# Altium schematic sheet Block Diagram.SchDoc: Safety - Block Diagram
size Letter; DrawnBy: Qinyang Bao; Organization: UW Robotics; Address1: 200 University Avenue; Address2: Waterloo; Address3: Ontario; Address4: Canada N2L 3G6
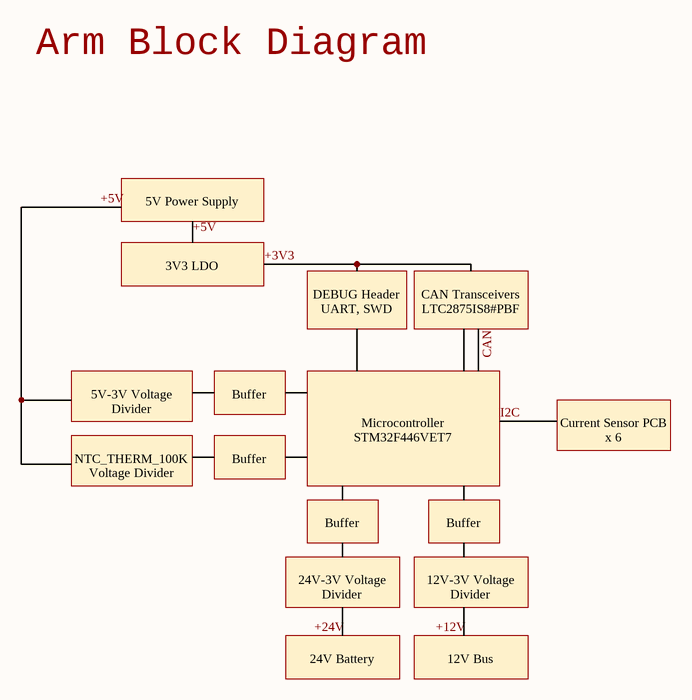
[diagram p0: Block Diagram.SchDoc]

## Notes on the sheet
- Arm Block Diagram
- 5V Power Supply
- 3V3 LDO
- DEBUG Header
  UART, SWD
- CAN Transceivers
  LTC2875IS8#PBF
- 5V-3V Voltage Divider
- Buffer
- Current Sensor PCB x 6
- NTC_THERM_100K Voltage Divider
- Microcontroller
  STM32F446VET7
- 24V-3V Voltage Divider
- 12V-3V Voltage Divider
- 24V Battery
- 12V Bus
- Labels drawn without touching a wire or pin: +12V, +24V
- Title
- Size:
- Date:
- Letter
- Drawn By:
- Sheet
- of
- File: